# EAGLE schematic K019 (EAGLE 6.3), part 1 of 2

## Sheet 1 of 4
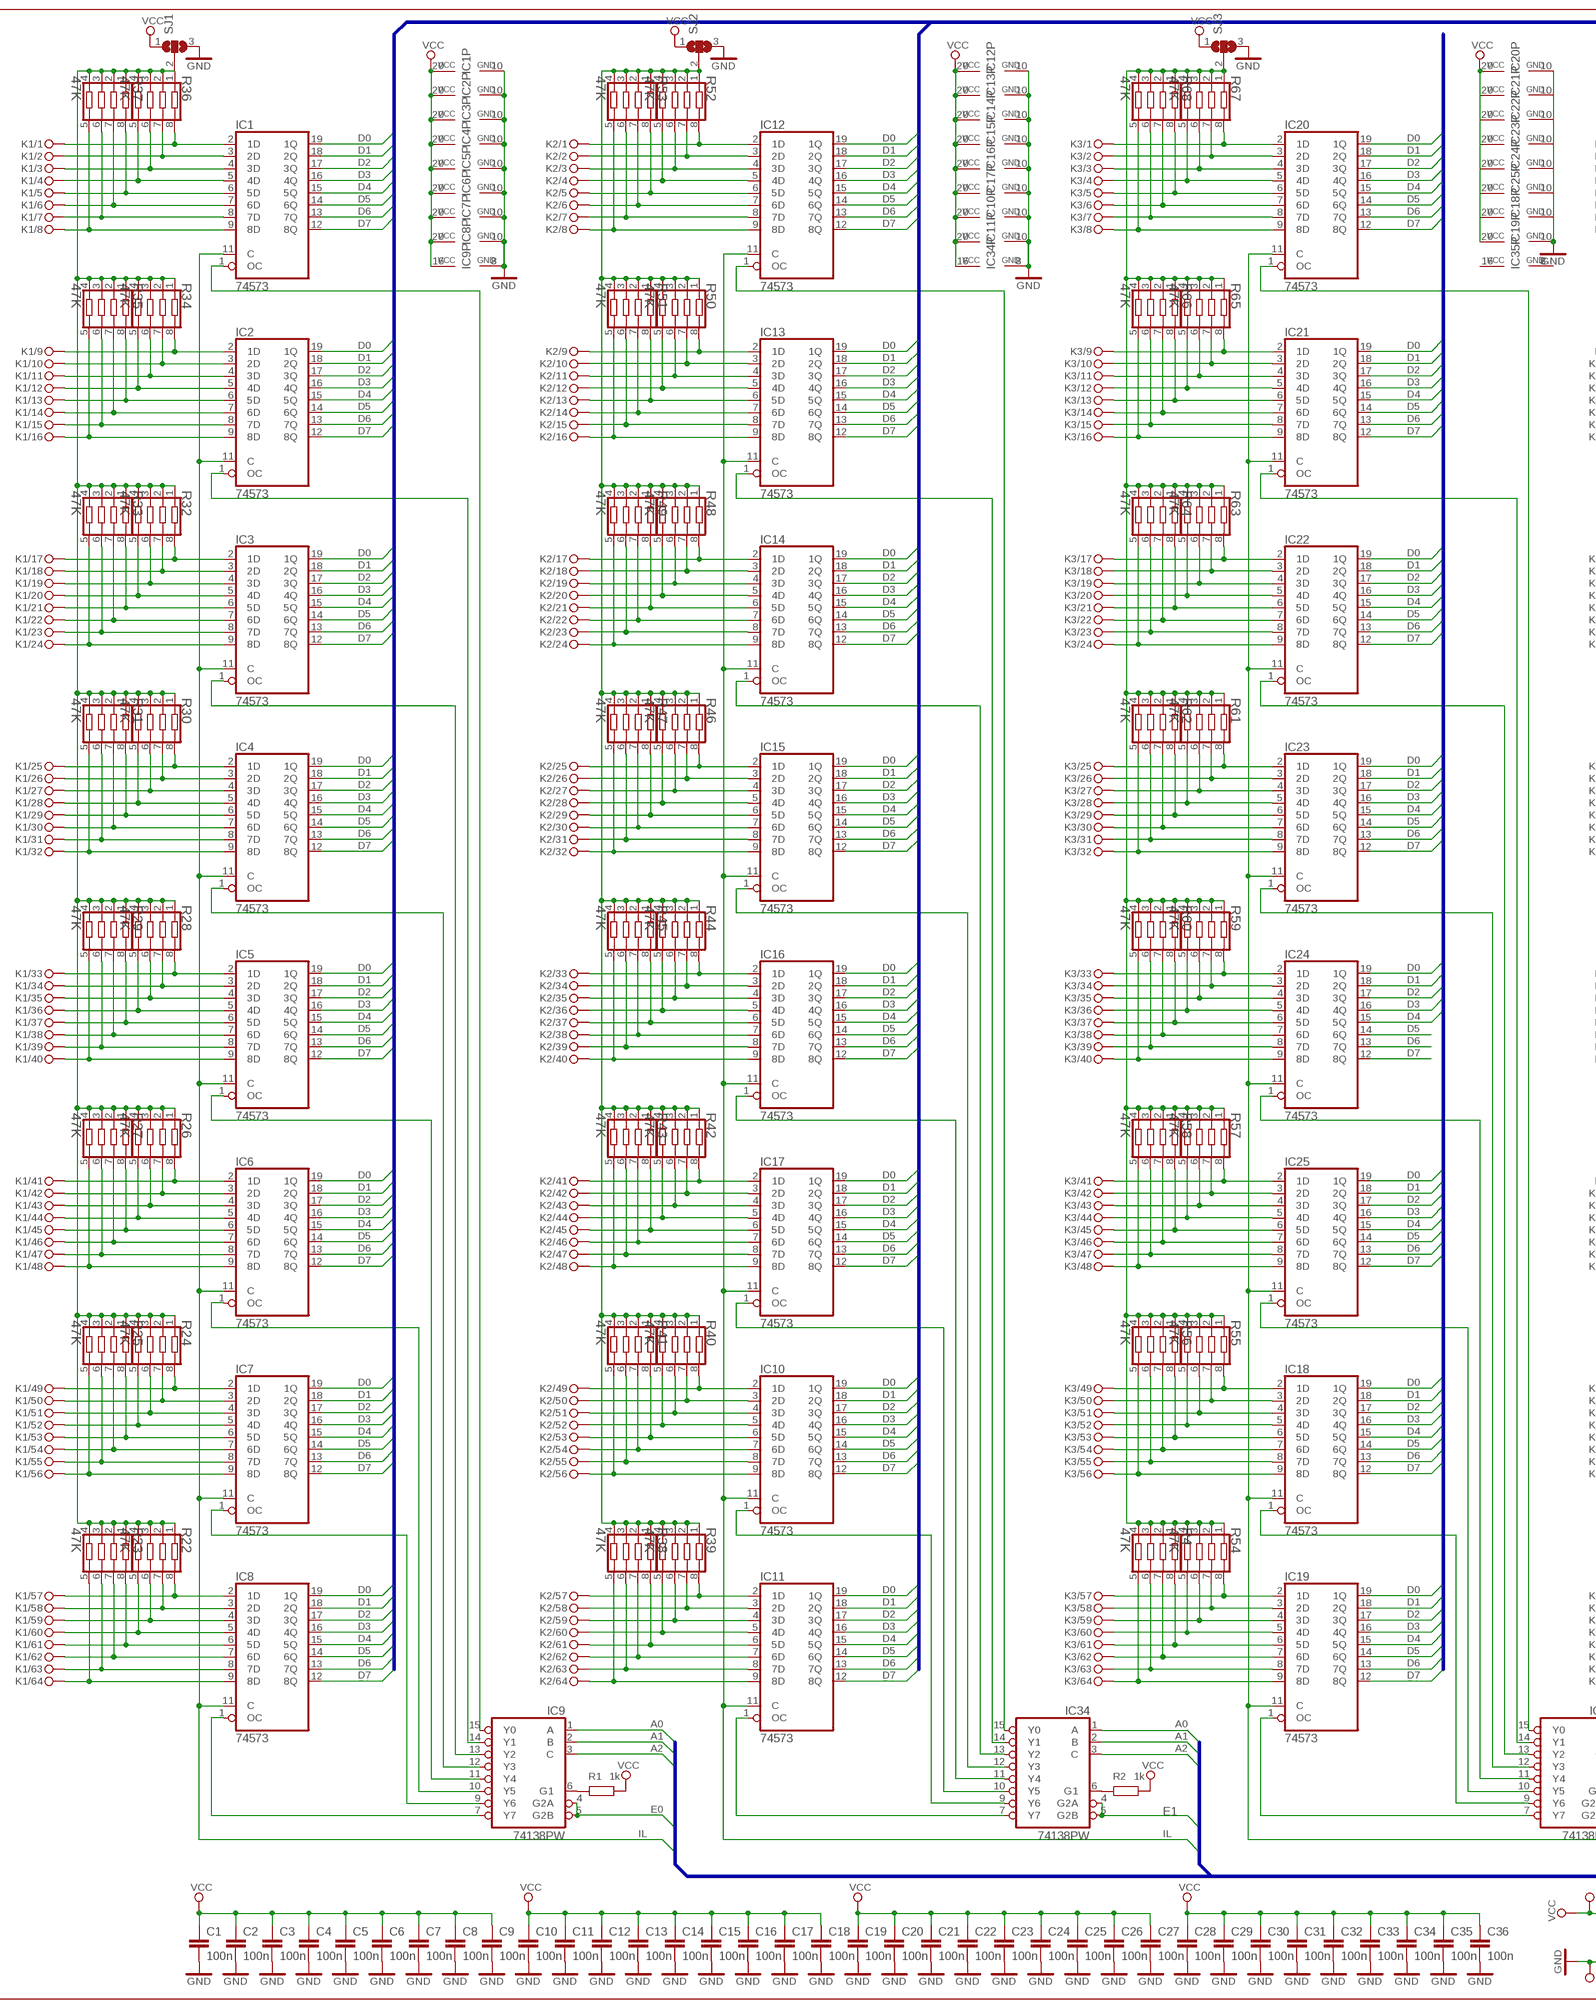
[diagram p0: schematic, sheet 1, part 1 of 2]
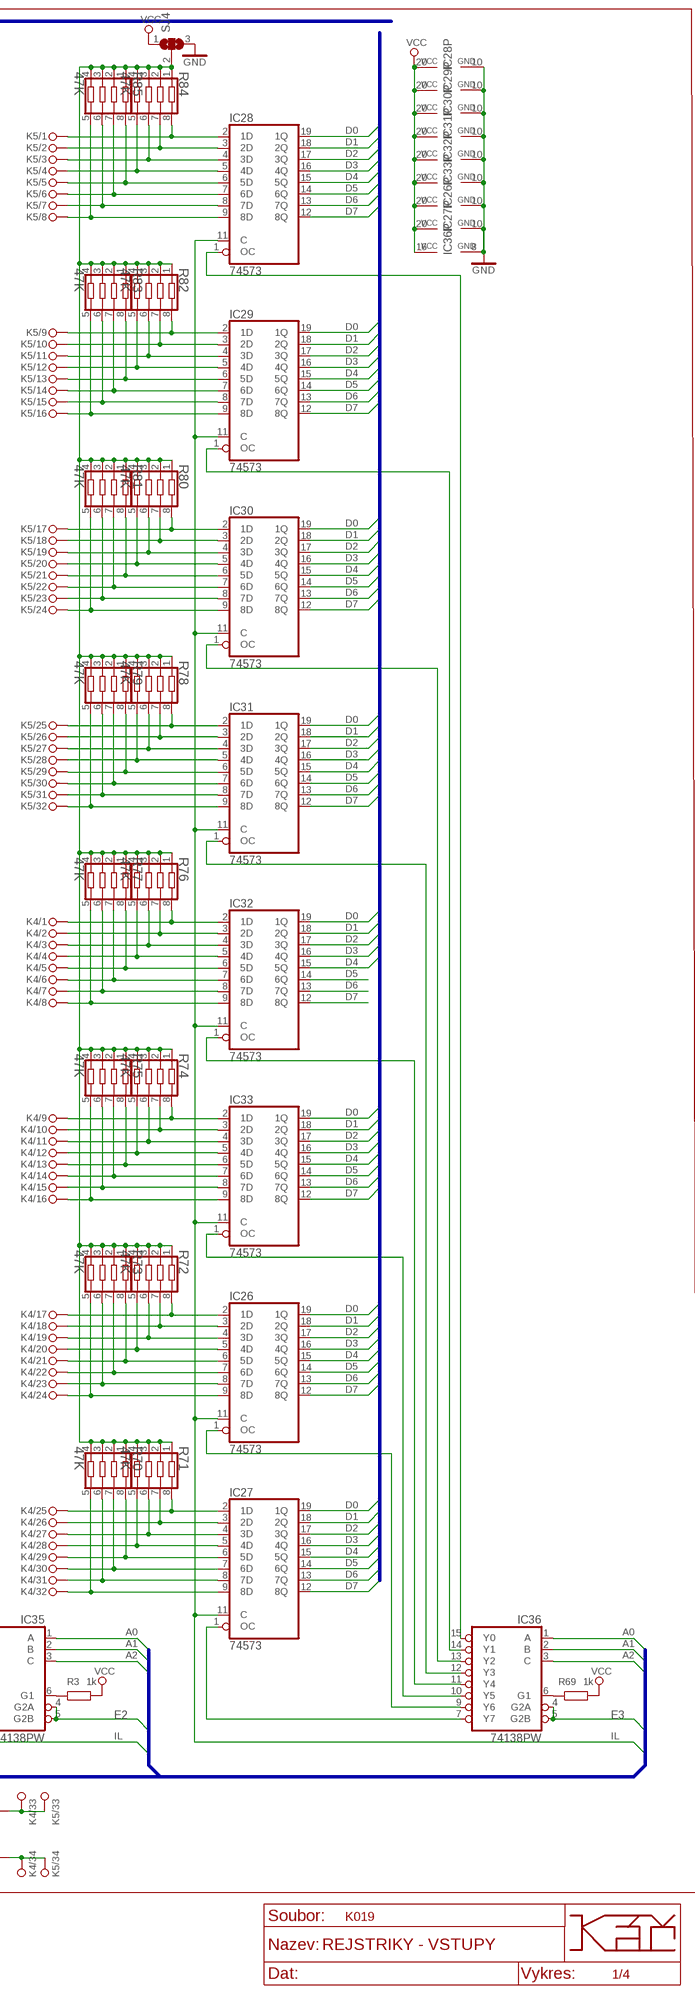
[diagram p1: schematic, sheet 1, part 2 of 2]

### Parts
C1  100n  C-EUC0603  [C0603]
C2  100n  C-EUC0603  [C0603]
C3  100n  C-EUC0603  [C0603]
C4  100n  C-EUC0603  [C0603]
C5  100n  C-EUC0603  [C0603]
C6  100n  C-EUC0603  [C0603]
C7  100n  C-EUC0603  [C0603]
C8  100n  C-EUC0603  [C0603]
C9  100n  C-EUC0603  [C0603]
C10  100n  C-EUC0603  [C0603]
C11  100n  C-EUC0603  [C0603]
C12  100n  C-EUC0603  [C0603]
C13  100n  C-EUC0603  [C0603]
C14  100n  C-EUC0603  [C0603]
C15  100n  C-EUC0603  [C0603]
C16  100n  C-EUC0603  [C0603]
C17  100n  C-EUC0603  [C0603]
C18  100n  C-EUC0603  [C0603]
C19  100n  C-EUC0603  [C0603]
C20  100n  C-EUC0603  [C0603]
C21  100n  C-EUC0603  [C0603]
C22  100n  C-EUC0603  [C0603]
C23  100n  C-EUC0603  [C0603]
C24  100n  C-EUC0603  [C0603]
C25  100n  C-EUC0603  [C0603]
C26  100n  C-EUC0603  [C0603]
C27  100n  C-EUC0603  [C0603]
C28  100n  C-EUC0603  [C0603]
C29  100n  C-EUC0603  [C0603]
C30  100n  C-EUC0603  [C0603]
C31  100n  C-EUC0603  [C0603]
C32  100n  C-EUC0603  [C0603]
C33  100n  C-EUC0603  [C0603]
C34  100n  C-EUC0603  [C0603]
C35  100n  C-EUC0603  [C0603]
C36  100n  C-EUC0603  [C0603]
IC1  74573  [TSSOP20]
IC2  74573  [TSSOP20]
IC3  74573  [TSSOP20]
IC4  74573  [TSSOP20]
IC5  74573  [TSSOP20]
IC6  74573  [TSSOP20]
IC7  74573  [TSSOP20]
IC8  74573  [TSSOP20]
IC9  74138PW  [TSSOP16]
IC10  74573  [TSSOP20]
IC11  74573  [TSSOP20]
IC12  74573  [TSSOP20]
IC13  74573  [TSSOP20]
IC14  74573  [TSSOP20]
IC15  74573  [TSSOP20]
IC16  74573  [TSSOP20]
IC17  74573  [TSSOP20]
IC18  74573  [TSSOP20]
IC19  74573  [TSSOP20]
IC20  74573  [TSSOP20]
IC21  74573  [TSSOP20]
IC22  74573  [TSSOP20]
IC23  74573  [TSSOP20]
IC24  74573  [TSSOP20]
IC25  74573  [TSSOP20]
IC26  74573  [TSSOP20]
IC27  74573  [TSSOP20]
IC28  74573  [TSSOP20]
IC29  74573  [TSSOP20]
IC30  74573  [TSSOP20]
IC31  74573  [TSSOP20]
IC32  74573  [TSSOP20]
IC33  74573  [TSSOP20]
IC34  74138PW  [TSSOP16]
IC35  74138PW  [TSSOP16]
IC36  74138PW  [TSSOP16]
K1  KON64  [KON64]
K2  KON64  [KON64]
K3  KON64  [KON64]
K4  KON34  [KON34]
K5  KON34  [KON34]
R1  1k  R-EU_R0603  [R0603]
R2  1k  R-EU_R0603  [R0603]
R3  1k  R-EU_R0603  [R0603]
R4  47K  EXB38V473JV  [RESCAXE80P320X160X60-8N]
R22  47K  EXB38V473JV  [RESCAXE80P320X160X60-8N]
R23  47K  EXB38V473JV  [RESCAXE80P320X160X60-8N]
R24  47K  EXB38V473JV  [RESCAXE80P320X160X60-8N]
R25  47K  EXB38V473JV  [RESCAXE80P320X160X60-8N]
R26  47K  EXB38V473JV  [RESCAXE80P320X160X60-8N]
R27  47K  EXB38V473JV  [RESCAXE80P320X160X60-8N]
R28  47K  EXB38V473JV  [RESCAXE80P320X160X60-8N]
R29  47K  EXB38V473JV  [RESCAXE80P320X160X60-8N]
R30  47K  EXB38V473JV  [RESCAXE80P320X160X60-8N]
R31  47K  EXB38V473JV  [RESCAXE80P320X160X60-8N]
R32  47K  EXB38V473JV  [RESCAXE80P320X160X60-8N]
R33  47K  EXB38V473JV  [RESCAXE80P320X160X60-8N]
R34  47K  EXB38V473JV  [RESCAXE80P320X160X60-8N]
R35  47K  EXB38V473JV  [RESCAXE80P320X160X60-8N]
R36  47K  EXB38V473JV  [RESCAXE80P320X160X60-8N]
R37  47K  EXB38V473JV  [RESCAXE80P320X160X60-8N]
R38  47K  EXB38V473JV  [RESCAXE80P320X160X60-8N]
R39  47K  EXB38V473JV  [RESCAXE80P320X160X60-8N]
R40  47K  EXB38V473JV  [RESCAXE80P320X160X60-8N]
R41  47K  EXB38V473JV  [RESCAXE80P320X160X60-8N]
R42  47K  EXB38V473JV  [RESCAXE80P320X160X60-8N]
R43  47K  EXB38V473JV  [RESCAXE80P320X160X60-8N]
R44  47K  EXB38V473JV  [RESCAXE80P320X160X60-8N]
R45  47K  EXB38V473JV  [RESCAXE80P320X160X60-8N]
R46  47K  EXB38V473JV  [RESCAXE80P320X160X60-8N]
R47  47K  EXB38V473JV  [RESCAXE80P320X160X60-8N]
R48  47K  EXB38V473JV  [RESCAXE80P320X160X60-8N]
R49  47K  EXB38V473JV  [RESCAXE80P320X160X60-8N]
R50  47K  EXB38V473JV  [RESCAXE80P320X160X60-8N]
R51  47K  EXB38V473JV  [RESCAXE80P320X160X60-8N]
R52  47K  EXB38V473JV  [RESCAXE80P320X160X60-8N]
R53  47K  EXB38V473JV  [RESCAXE80P320X160X60-8N]
R54  47K  EXB38V473JV  [RESCAXE80P320X160X60-8N]
R55  47K  EXB38V473JV  [RESCAXE80P320X160X60-8N]
R56  47K  EXB38V473JV  [RESCAXE80P320X160X60-8N]
R57  47K  EXB38V473JV  [RESCAXE80P320X160X60-8N]
R58  47K  EXB38V473JV  [RESCAXE80P320X160X60-8N]
R59  47K  EXB38V473JV  [RESCAXE80P320X160X60-8N]
R60  47K  EXB38V473JV  [RESCAXE80P320X160X60-8N]
R61  47K  EXB38V473JV  [RESCAXE80P320X160X60-8N]
R62  47K  EXB38V473JV  [RESCAXE80P320X160X60-8N]
R63  47K  EXB38V473JV  [RESCAXE80P320X160X60-8N]
R64  47K  EXB38V473JV  [RESCAXE80P320X160X60-8N]
R65  47K  EXB38V473JV  [RESCAXE80P320X160X60-8N]
R66  47K  EXB38V473JV  [RESCAXE80P320X160X60-8N]
R67  47K  EXB38V473JV  [RESCAXE80P320X160X60-8N]
R68  47K  EXB38V473JV  [RESCAXE80P320X160X60-8N]
R69  1k  R-EU_R0603  [R0603]
R70  47K  EXB38V473JV  [RESCAXE80P320X160X60-8N]
R71  47K  EXB38V473JV  [RESCAXE80P320X160X60-8N]
R72  47K  EXB38V473JV  [RESCAXE80P320X160X60-8N]
R73  47K  EXB38V473JV  [RESCAXE80P320X160X60-8N]
R74  47K  EXB38V473JV  [RESCAXE80P320X160X60-8N]
R75  47K  EXB38V473JV  [RESCAXE80P320X160X60-8N]
R76  47K  EXB38V473JV  [RESCAXE80P320X160X60-8N]
R77  47K  EXB38V473JV  [RESCAXE80P320X160X60-8N]
R78  47K  EXB38V473JV  [RESCAXE80P320X160X60-8N]
R79  47K  EXB38V473JV  [RESCAXE80P320X160X60-8N]
R80  47K  EXB38V473JV  [RESCAXE80P320X160X60-8N]
R81  47K  EXB38V473JV  [RESCAXE80P320X160X60-8N]
R82  47K  EXB38V473JV  [RESCAXE80P320X160X60-8N]
R83  47K  EXB38V473JV  [RESCAXE80P320X160X60-8N]
R84  47K  EXB38V473JV  [RESCAXE80P320X160X60-8N]
R85  47K  EXB38V473JV  [RESCAXE80P320X160X60-8N]
SJ1  SJ2W  [SJ_2]
SJ2  SJ2W  [SJ_2]
SJ3  SJ2W  [SJ_2]
SJ4  SJ2W  [SJ_2]

### Nets
A0: IC9.1(A) IC34.1(A) IC35.1(A) IC36.1(A) ; also sheet 2,3,4
A1: IC9.2(B) IC34.2(B) IC35.2(B) IC36.2(B) ; also sheet 2,3,4
A2: IC9.3(C) IC34.3(C) IC35.3(C) IC36.3(C) ; also sheet 2,3,4
D0: IC1.19(1Q) IC2.19(1Q) IC3.19(1Q) IC4.19(1Q) IC5.19(1Q) IC6.19(1Q) IC7.19(1Q) IC8.19(1Q) IC10.19(1Q) IC11.19(1Q) IC12.19(1Q) IC13.19(1Q) IC14.19(1Q) IC15.19(1Q) IC16.19(1Q) IC17.19(1Q) IC18.19(1Q) IC19.19(1Q) IC20.19(1Q) IC21.19(1Q) IC22.19(1Q) IC23.19(1Q) IC24.19(1Q) IC25.19(1Q) IC26.19(1Q) IC27.19(1Q) IC28.19(1Q) IC29.19(1Q) IC30.19(1Q) IC31.19(1Q) IC32.19(1Q) IC33.19(1Q) ; also sheet 2,3,4
D1: IC1.18(2Q) IC2.18(2Q) IC3.18(2Q) IC4.18(2Q) IC5.18(2Q) IC6.18(2Q) IC7.18(2Q) IC8.18(2Q) IC10.18(2Q) IC11.18(2Q) IC12.18(2Q) IC13.18(2Q) IC14.18(2Q) IC15.18(2Q) IC16.18(2Q) IC17.18(2Q) IC18.18(2Q) IC19.18(2Q) IC20.18(2Q) IC21.18(2Q) IC22.18(2Q) IC23.18(2Q) IC24.18(2Q) IC25.18(2Q) IC26.18(2Q) IC27.18(2Q) IC28.18(2Q) IC29.18(2Q) IC30.18(2Q) IC31.18(2Q) IC32.18(2Q) IC33.18(2Q) ; also sheet 2,3,4
D2: IC1.17(3Q) IC2.17(3Q) IC3.17(3Q) IC4.17(3Q) IC5.17(3Q) IC6.17(3Q) IC7.17(3Q) IC8.17(3Q) IC10.17(3Q) IC11.17(3Q) IC12.17(3Q) IC13.17(3Q) IC14.17(3Q) IC15.17(3Q) IC16.17(3Q) IC17.17(3Q) IC18.17(3Q) IC19.17(3Q) IC20.17(3Q) IC21.17(3Q) IC22.17(3Q) IC23.17(3Q) IC24.17(3Q) IC25.17(3Q) IC26.17(3Q) IC27.17(3Q) IC28.17(3Q) IC29.17(3Q) IC30.17(3Q) IC31.17(3Q) IC32.17(3Q) IC33.17(3Q) ; also sheet 2,3,4
D3: IC1.16(4Q) IC2.16(4Q) IC3.16(4Q) IC4.16(4Q) IC5.16(4Q) IC6.16(4Q) IC7.16(4Q) IC8.16(4Q) IC10.16(4Q) IC11.16(4Q) IC12.16(4Q) IC13.16(4Q) IC14.16(4Q) IC15.16(4Q) IC16.16(4Q) IC17.16(4Q) IC18.16(4Q) IC19.16(4Q) IC20.16(4Q) IC21.16(4Q) IC22.16(4Q) IC23.16(4Q) IC24.16(4Q) IC25.16(4Q) IC26.16(4Q) IC27.16(4Q) IC28.16(4Q) IC29.16(4Q) IC30.16(4Q) IC31.16(4Q) IC32.16(4Q) IC33.16(4Q) ; also sheet 2,3,4
D4: IC1.15(5Q) IC2.15(5Q) IC3.15(5Q) IC4.15(5Q) IC5.15(5Q) IC6.15(5Q) IC7.15(5Q) IC8.15(5Q) IC10.15(5Q) IC11.15(5Q) IC12.15(5Q) IC13.15(5Q) IC14.15(5Q) IC15.15(5Q) IC16.15(5Q) IC17.15(5Q) IC18.15(5Q) IC19.15(5Q) IC20.15(5Q) IC21.15(5Q) IC22.15(5Q) IC23.15(5Q) IC24.15(5Q) IC25.15(5Q) IC26.15(5Q) IC27.15(5Q) IC28.15(5Q) IC29.15(5Q) IC30.15(5Q) IC31.15(5Q) IC32.15(5Q) IC33.15(5Q) ; also sheet 2,3,4
D5: IC1.14(6Q) IC2.14(6Q) IC3.14(6Q) IC4.14(6Q) IC5.14(6Q) IC6.14(6Q) IC7.14(6Q) IC8.14(6Q) IC10.14(6Q) IC11.14(6Q) IC12.14(6Q) IC13.14(6Q) IC14.14(6Q) IC15.14(6Q) IC16.14(6Q) IC17.14(6Q) IC18.14(6Q) IC19.14(6Q) IC20.14(6Q) IC21.14(6Q) IC22.14(6Q) IC23.14(6Q) IC24.14(6Q) IC25.14(6Q) IC26.14(6Q) IC27.14(6Q) IC28.14(6Q) IC29.14(6Q) IC30.14(6Q) IC31.14(6Q) IC32.14(6Q) IC33.14(6Q) ; also sheet 2,3,4
D6: IC1.13(7Q) IC2.13(7Q) IC3.13(7Q) IC4.13(7Q) IC5.13(7Q) IC6.13(7Q) IC7.13(7Q) IC8.13(7Q) IC10.13(7Q) IC11.13(7Q) IC12.13(7Q) IC13.13(7Q) IC14.13(7Q) IC15.13(7Q) IC16.13(7Q) IC17.13(7Q) IC18.13(7Q) IC19.13(7Q) IC20.13(7Q) IC21.13(7Q) IC22.13(7Q) IC23.13(7Q) IC24.13(7Q) IC25.13(7Q) IC26.13(7Q) IC27.13(7Q) IC28.13(7Q) IC29.13(7Q) IC30.13(7Q) IC31.13(7Q) IC32.13(7Q) IC33.13(7Q) ; also sheet 2,3,4
D7: IC1.12(8Q) IC2.12(8Q) IC3.12(8Q) IC4.12(8Q) IC5.12(8Q) IC6.12(8Q) IC7.12(8Q) IC8.12(8Q) IC10.12(8Q) IC11.12(8Q) IC12.12(8Q) IC13.12(8Q) IC14.12(8Q) IC15.12(8Q) IC16.12(8Q) IC17.12(8Q) IC18.12(8Q) IC19.12(8Q) IC20.12(8Q) IC21.12(8Q) IC22.12(8Q) IC23.12(8Q) IC24.12(8Q) IC25.12(8Q) IC26.12(8Q) IC27.12(8Q) IC28.12(8Q) IC29.12(8Q) IC30.12(8Q) IC31.12(8Q) IC32.12(8Q) IC33.12(8Q) ; also sheet 2,3,4
E0: IC9.4(G2A) IC9.5(G2B) ; also sheet 4
E1: IC34.4(G2A) IC34.5(G2B) ; also sheet 4
E2: IC35.4(G2A) IC35.5(G2B) ; also sheet 4
E3: IC36.4(G2A) IC36.5(G2B) ; also sheet 4
GND: C1.2 C2.2 C3.2 C4.2 C5.2 C6.2 C7.2 C8.2 C9.2 C10.2 C11.2 C12.2 C13.2 C14.2 C15.2 C16.2 C17.2 C18.2 C19.2 C20.2 C21.2 C22.2 C23.2 C24.2 C25.2 C26.2 C27.2 C28.2 C29.2 C30.2 C31.2 C32.2 C33.2 C34.2 C35.2 C36.2 IC1.10(GND) IC2.10(GND) IC3.10(GND) IC4.10(GND) IC5.10(GND) IC6.10(GND) IC7.10(GND) IC8.10(GND) IC9.8(GND) IC10.10(GND) IC11.10(GND) IC12.10(GND) IC13.10(GND) IC14.10(GND) IC15.10(GND) IC16.10(GND) IC17.10(GND) IC18.10(GND) IC19.10(GND) IC20.10(GND) IC21.10(GND) IC22.10(GND) IC23.10(GND) IC24.10(GND) IC25.10(GND) IC26.10(GND) IC27.10(GND) IC28.10(GND) IC29.10(GND) IC30.10(GND) IC31.10(GND) IC32.10(GND) IC33.10(GND) IC36.8(GND) K4.34 K5.34 SJ1.3 SJ2.3 SJ3.3 SJ4.3 ; also sheet 2,3,4
IL: IC1.11(C) IC2.11(C) IC3.11(C) IC4.11(C) IC5.11(C) IC6.11(C) IC7.11(C) IC8.11(C) IC10.11(C) IC11.11(C) IC12.11(C) IC13.11(C) IC14.11(C) IC15.11(C) IC16.11(C) IC17.11(C) IC18.11(C) IC19.11(C) IC20.11(C) IC21.11(C) IC22.11(C) IC23.11(C) IC24.11(C) IC25.11(C) IC26.11(C) IC27.11(C) IC28.11(C) IC29.11(C) IC30.11(C) IC31.11(C) IC32.11(C) IC33.11(C) ; also sheet 4
N$1: IC8.1(OC) IC9.7(Y7)
N$2: IC7.1(OC) IC9.9(Y6)
N$3: IC6.1(OC) IC9.10(Y5)
N$4: IC5.1(OC) IC9.11(Y4)
N$5: IC4.1(OC) IC9.12(Y3)
N$6: IC3.1(OC) IC9.13(Y2)
N$7: IC2.1(OC) IC9.14(Y1)
N$8: IC1.1(OC) IC9.15(Y0)
N$9: IC11.1(OC) IC34.7(Y7)
N$10: IC1.2(1D) K1.1 R36.8
N$11: IC1.3(2D) K1.2 R36.7
N$12: IC1.4(3D) K1.3 R36.6
N$13: IC1.5(4D) K1.4 R36.5
N$14: IC1.6(5D) K1.5 R37.8
N$15: IC1.7(6D) K1.6 R37.7
N$16: IC1.8(7D) K1.7 R37.6
N$17: IC1.9(8D) K1.8 R37.5
N$18: IC2.2(1D) K1.9 R34.8
N$19: IC2.3(2D) K1.10 R34.7
N$20: IC2.4(3D) K1.11 R34.6
N$21: IC2.5(4D) K1.12 R34.5
N$22: IC2.6(5D) K1.13 R35.8
N$23: IC2.7(6D) K1.14 R35.7
N$24: IC2.8(7D) K1.15 R35.6
N$25: IC2.9(8D) K1.16 R35.5
N$26: IC3.2(1D) K1.17 R32.8
N$27: IC10.1(OC) IC34.9(Y6)
N$28: IC3.4(3D) K1.19 R32.6
N$29: IC3.5(4D) K1.20 R32.5
N$30: IC3.6(5D) K1.21 R33.8
N$31: IC3.7(6D) K1.22 R33.7
N$32: IC3.8(7D) K1.23 R33.6
N$33: IC3.9(8D) K1.24 R33.5
N$34: IC4.2(1D) K1.25 R30.8
N$35: IC4.3(2D) K1.26 R30.7
N$36: IC4.4(3D) K1.27 R30.6
N$37: IC4.5(4D) K1.28 R30.5
N$38: IC4.6(5D) K1.29 R31.8
N$39: IC4.7(6D) K1.30 R31.7
N$40: IC4.8(7D) K1.31 R31.6
N$41: IC4.9(8D) K1.32 R31.5
N$42: IC5.2(1D) K1.33 R28.8
N$43: IC5.3(2D) K1.34 R28.7
N$44: IC5.4(3D) K1.35 R28.6
N$45: IC5.5(4D) K1.36 R28.5
N$46: IC5.6(5D) K1.37 R29.8
N$47: IC5.7(6D) K1.38 R29.7
N$48: IC5.8(7D) K1.39 R29.6
N$49: IC5.9(8D) K1.40 R29.5
N$50: IC6.2(1D) K1.41 R26.8
N$51: IC6.3(2D) K1.42 R26.7
N$52: IC6.4(3D) K1.43 R26.6
N$53: IC6.5(4D) K1.44 R26.5
N$54: IC6.6(5D) K1.45 R27.8
N$55: IC6.7(6D) K1.46 R27.7
N$56: IC6.8(7D) K1.47 R27.6
N$57: IC6.9(8D) K1.48 R27.5
N$58: IC7.2(1D) K1.49 R24.8
N$59: IC7.3(2D) K1.50 R24.7
N$60: IC7.4(3D) K1.51 R24.6
N$61: IC7.5(4D) K1.52 R24.5
N$62: IC7.6(5D) K1.53 R25.8
N$63: IC7.7(6D) K1.54 R25.7
N$64: IC7.8(7D) K1.55 R25.6
N$65: IC7.9(8D) K1.56 R25.5
N$66: IC8.2(1D) K1.57 R22.8
N$67: IC8.3(2D) K1.58 R22.7
N$68: IC8.4(3D) K1.59 R22.6
N$69: IC8.5(4D) K1.60 R22.5
N$70: IC8.6(5D) K1.61 R23.8
N$71: IC8.7(6D) K1.62 R23.7
N$72: IC8.8(7D) K1.63 R23.6
N$73: IC8.9(8D) K1.64 R23.5
N$74: IC17.1(OC) IC34.10(Y5)
N$75: IC16.1(OC) IC34.11(Y4)
N$76: R22.1 R22.2 R22.3 R22.4 R23.1 R23.2 R23.3 R23.4 R24.1 R24.2 R24.3 R24.4 R25.1 R25.2 R25.3 R25.4 R26.1 R26.2 R26.3 R26.4 R27.1 R27.2 R27.3 R27.4 R28.1 R28.2 R28.3 R28.4 R29.1 R29.2 R29.3 R29.4 R30.1 R30.2 R30.3 R30.4 R31.1 R31.2 R31.3 R31.4 R32.1 R32.2 R32.3 R32.4 R33.1 R33.2 R33.3 R33.4 R34.1 R34.2 R34.3 R34.4 R35.1 R35.2 R35.3 R35.4 R36.1 R36.2 R36.3 R36.4 R37.1 R37.2 R37.3 R37.4 SJ1.2
N$77: IC15.1(OC) IC34.12(Y3)
N$78: IC14.1(OC) IC34.13(Y2)
N$79: IC13.1(OC) IC34.14(Y1)
N$80: IC12.1(OC) IC34.15(Y0)
N$81: IC19.1(OC) IC35.7(Y7)
N$82: IC18.1(OC) IC35.9(Y6)
N$83: IC9.6(G1) R1.1
N$84: IC25.1(OC) IC35.10(Y5)
N$85: IC24.1(OC) IC35.11(Y4)
N$86: IC3.3(2D) K1.18 R32.7
N$87: IC23.1(OC) IC35.12(Y3)
N$88: IC22.1(OC) IC35.13(Y2)
N$89: IC21.1(OC) IC35.14(Y1)
N$90: IC20.1(OC) IC35.15(Y0)
N$92: IC27.1(OC) IC36.7(Y7)
N$93: IC26.1(OC) IC36.9(Y6)
N$94: IC33.1(OC) IC36.10(Y5)
N$95: IC32.1(OC) IC36.11(Y4)
N$96: IC31.1(OC) IC36.12(Y3)
N$97: IC30.1(OC) IC36.13(Y2)
N$98: IC29.1(OC) IC36.14(Y1)
N$99: IC28.1(OC) IC36.15(Y0)
N$151: R38.1 R38.2 R38.3 R38.4 R39.1 R39.2 R39.3 R39.4 R40.1 R40.2 R40.3 R40.4 R41.1 R41.2 R41.3 R41.4 R42.1 R42.2 R42.3 R42.4 R43.1 R43.2 R43.3 R43.4 R44.1 R44.2 R44.3 R44.4 R45.1 R45.2 R45.3 R45.4 R46.1 R46.2 R46.3 R46.4 R47.1 R47.2 R47.3 R47.4 R48.1 R48.2 R48.3 R48.4 R49.1 R49.2 R49.3 R49.4 R50.1 R50.2 R50.3 R50.4 R51.1 R51.2 R51.3 R51.4 R52.1 R52.2 R52.3 R52.4 R53.1 R53.2 R53.3 R53.4 SJ2.2
N$220: R4.1 R4.2 R4.3 R4.4 R54.1 R54.2 R54.3 R54.4 R55.1 R55.2 R55.3 R55.4 R56.1 R56.2 R56.3 R56.4 R57.1 R57.2 R57.3 R57.4 R58.1 R58.2 R58.3 R58.4 R59.1 R59.2 R59.3 R59.4 R60.1 R60.2 R60.3 R60.4 R61.1 R61.2 R61.3 R61.4 R62.1 R62.2 R62.3 R62.4 R63.1 R63.2 R63.3 R63.4 R64.1 R64.2 R64.3 R64.4 R65.1 R65.2 R65.3 R65.4 R66.1 R66.2 R66.3 R66.4 R67.1 R67.2 R67.3 R67.4 R68.1 R68.2 R68.3 R68.4 SJ3.2
N$418: R70.1 R70.2 R70.3 R70.4 R71.1 R71.2 R71.3 R71.4 R72.1 R72.2 R72.3 R72.4 R73.1 R73.2 R73.3 R73.4 R74.1 R74.2 R74.3 R74.4 R75.1 R75.2 R75.3 R75.4 R76.1 R76.2 R76.3 R76.4 R77.1 R77.2 R77.3 R77.4 R78.1 R78.2 R78.3 R78.4 R79.1 R79.2 R79.3 R79.4 R80.1 R80.2 R80.3 R80.4 R81.1 R81.2 R81.3 R81.4 R82.1 R82.2 R82.3 R82.4 R83.1 R83.2 R83.3 R83.4 R84.1 R84.2 R84.3 R84.4 R85.1 R85.2 R85.3 R85.4 SJ4.2
N$419: IC12.2(1D) K2.1 R52.8
N$1295: IC12.3(2D) K2.2 R52.7
N$1296: IC12.4(3D) K2.3 R52.6
N$1297: IC12.5(4D) K2.4 R52.5
N$1298: IC12.6(5D) K2.5 R53.8
N$1299: IC12.7(6D) K2.6 R53.7
N$1300: IC12.8(7D) K2.7 R53.6
N$1301: IC12.9(8D) K2.8 R53.5
N$1302: IC13.2(1D) K2.9 R50.8
N$1303: IC13.3(2D) K2.10 R50.7
N$1304: IC13.4(3D) K2.11 R50.6
N$1305: IC13.5(4D) K2.12 R50.5
N$1306: IC13.6(5D) K2.13 R51.8
N$1307: IC13.7(6D) K2.14 R51.7
N$1308: IC13.8(7D) K2.15 R51.6
N$1309: IC13.9(8D) K2.16 R51.5
N$1310: IC14.2(1D) K2.17 R48.8
N$1311: IC14.3(2D) K2.18 R48.7
N$1312: IC14.4(3D) K2.19 R48.6
N$1313: IC14.5(4D) K2.20 R48.5
N$1314: IC14.6(5D) K2.21 R49.8
N$1315: IC14.7(6D) K2.22 R49.7
N$1316: IC14.8(7D) K2.23 R49.6
N$1317: IC14.9(8D) K2.24 R49.5
N$1318: IC15.2(1D) K2.25 R46.8
N$1319: IC15.3(2D) K2.26 R46.7
N$1320: IC15.4(3D) K2.27 R46.6
N$1321: IC15.5(4D) K2.28 R46.5
N$1322: IC15.6(5D) K2.29 R47.8
N$1323: IC15.7(6D) K2.30 R47.7
N$1324: IC15.8(7D) K2.31 R47.6
N$1325: IC15.9(8D) K2.32 R47.5
N$1326: IC16.2(1D) K2.33 R44.8
N$1327: IC16.3(2D) K2.34 R44.7
N$1328: IC16.4(3D) K2.35 R44.6
N$1329: IC16.5(4D) K2.36 R44.5
N$1330: IC16.6(5D) K2.37 R45.8
N$1331: IC16.7(6D) K2.38 R45.7
N$1332: IC16.8(7D) K2.39 R45.6
N$1333: IC16.9(8D) K2.40 R45.5
N$1334: IC17.2(1D) K2.41 R42.8
N$1335: IC17.3(2D) K2.42 R42.7
N$1336: IC17.4(3D) K2.43 R42.6
N$1337: IC17.5(4D) K2.44 R42.5
N$1338: IC17.6(5D) K2.45 R43.8
N$1339: IC17.7(6D) K2.46 R43.7
N$1340: IC17.8(7D) K2.47 R43.6
N$1341: IC17.9(8D) K2.48 R43.5
N$1342: IC10.2(1D) K2.49 R40.8
N$1343: IC10.3(2D) K2.50 R40.7
N$1344: IC10.4(3D) K2.51 R40.6
N$1345: IC10.5(4D) K2.52 R40.5
N$1346: IC10.6(5D) K2.53 R41.8
N$1347: IC10.7(6D) K2.54 R41.7
N$1348: IC10.8(7D) K2.55 R41.6
N$1349: IC10.9(8D) K2.56 R41.5
N$1350: IC11.2(1D) K2.57 R39.8
N$1351: IC11.3(2D) K2.58 R39.7
N$1352: IC11.4(3D) K2.59 R39.6
N$1353: IC11.5(4D) K2.60 R39.5
N$1354: IC11.6(5D) K2.61 R38.8
N$1355: IC11.7(6D) K2.62 R38.7
N$1356: IC11.8(7D) K2.63 R38.6
N$1357: IC11.9(8D) K2.64 R38.5
N$1358: IC19.2(1D) K3.57 R54.8
N$1359: IC19.3(2D) K3.58 R54.7
N$1360: IC19.4(3D) K3.59 R54.6
N$1361: IC19.5(4D) K3.60 R54.5
N$1362: IC19.6(5D) K3.61 R4.8
N$1363: IC19.7(6D) K3.62 R4.7
N$1364: IC19.8(7D) K3.63 R4.6
N$1365: IC19.9(8D) K3.64 R4.5
N$1366: IC18.2(1D) K3.49 R55.8
N$1367: IC18.3(2D) K3.50 R55.7
N$1368: IC18.4(3D) K3.51 R55.6
N$1369: IC18.5(4D) K3.52 R55.5
N$1370: IC18.6(5D) K3.53 R56.8
N$1371: IC18.7(6D) K3.54 R56.7
N$1372: IC18.8(7D) K3.55 R56.6
N$1373: IC18.9(8D) K3.56 R56.5
N$1374: IC25.2(1D) K3.41 R57.8
N$1375: IC25.3(2D) K3.42 R57.7
N$1376: IC25.4(3D) K3.43 R57.6
N$1377: IC25.5(4D) K3.44 R57.5
N$1378: IC25.6(5D) K3.45 R58.8
N$1379: IC25.7(6D) K3.46 R58.7
N$1380: IC25.8(7D) K3.47 R58.6
N$1381: IC25.9(8D) K3.48 R58.5
N$1382: IC24.2(1D) K3.33 R59.8
N$1383: IC24.3(2D) K3.34 R59.7
N$1384: IC24.4(3D) K3.35 R59.6
N$1385: IC24.5(4D) K3.36 R59.5
N$1386: IC24.6(5D) K3.37 R60.8
N$1387: IC24.7(6D) K3.38 R60.7
N$1388: IC24.8(7D) K3.39 R60.6
N$1389: IC24.9(8D) K3.40 R60.5
N$1390: IC23.2(1D) K3.25 R61.8
N$1391: IC23.3(2D) K3.26 R61.7
N$1392: IC23.4(3D) K3.27 R61.6
N$1393: IC23.5(4D) K3.28 R61.5
N$1394: IC23.6(5D) K3.29 R62.8
N$1395: IC23.7(6D) K3.30 R62.7
N$1396: IC23.8(7D) K3.31 R62.6
N$1397: IC23.9(8D) K3.32 R62.5
N$1398: IC22.2(1D) K3.17 R63.8
N$1399: IC22.3(2D) K3.18 R63.7
N$1400: IC22.4(3D) K3.19 R63.6
N$1401: IC22.5(4D) K3.20 R63.5
N$1402: IC22.6(5D) K3.21 R64.8
N$1403: IC22.7(6D) K3.22 R64.7
N$1404: IC22.8(7D) K3.23 R64.6
N$1405: IC22.9(8D) K3.24 R64.5
N$1406: IC21.2(1D) K3.9 R65.8
N$1407: IC21.3(2D) K3.10 R65.7
N$1408: IC21.4(3D) K3.11 R65.6
N$1409: IC21.5(4D) K3.12 R65.5
N$1410: IC21.6(5D) K3.13 R66.8
N$1411: IC21.7(6D) K3.14 R66.7
N$1412: IC21.8(7D) K3.15 R66.6
N$1413: IC21.9(8D) K3.16 R66.5
N$1414: IC20.2(1D) K3.1 R67.8
N$1415: IC20.3(2D) K3.2 R67.7
N$1416: IC20.4(3D) K3.3 R67.6
N$1417: IC20.5(4D) K3.4 R67.5
N$1418: IC20.6(5D) K3.5 R68.8
N$1419: IC20.7(6D) K3.6 R68.7
N$1420: IC20.8(7D) K3.7 R68.6
N$1421: IC20.9(8D) K3.8 R68.5
N$1422: IC28.2(1D) K5.1 R84.8
N$1423: IC28.3(2D) K5.2 R84.7
N$1424: IC28.4(3D) K5.3 R84.6
N$1425: IC28.5(4D) K5.4 R84.5
N$1426: IC28.6(5D) K5.5 R85.8
N$1427: IC28.7(6D) K5.6 R85.7
N$1428: IC28.8(7D) K5.7 R85.6
N$1429: IC28.9(8D) K5.8 R85.5
N$1430: IC29.2(1D) K5.9 R82.8
N$1431: IC29.3(2D) K5.10 R82.7
N$1432: IC29.4(3D) K5.11 R82.6
N$1433: IC29.5(4D) K5.12 R82.5
N$1434: IC29.6(5D) K5.13 R83.8
N$1435: IC29.7(6D) K5.14 R83.7
N$1436: IC29.8(7D) K5.15 R83.6
N$1437: IC29.9(8D) K5.16 R83.5
N$1438: IC30.2(1D) K5.17 R80.8
N$1439: IC30.3(2D) K5.18 R80.7
N$1440: IC30.4(3D) K5.19 R80.6
N$1441: IC30.5(4D) K5.20 R80.5
N$1442: IC30.6(5D) K5.21 R81.8
N$1443: IC30.7(6D) K5.22 R81.7
N$1444: IC30.8(7D) K5.23 R81.6
N$1445: IC30.9(8D) K5.24 R81.5
N$1446: IC31.2(1D) K5.25 R78.8
N$1447: IC31.3(2D) K5.26 R78.7
N$1448: IC31.4(3D) K5.27 R78.6
N$1449: IC31.5(4D) K5.28 R78.5
N$1450: IC31.6(5D) K5.29 R79.8
N$1451: IC31.7(6D) K5.30 R79.7
N$1452: IC31.8(7D) K5.31 R79.6
N$1453: IC31.9(8D) K5.32 R79.5
N$1454: IC32.2(1D) K4.1 R76.8
N$1455: IC32.3(2D) K4.2 R76.7
N$1456: IC32.4(3D) K4.3 R76.6
N$1457: IC32.5(4D) K4.4 R76.5
N$1458: IC32.6(5D) K4.5 R77.8
N$1459: IC32.7(6D) K4.6 R77.7
N$1460: IC32.8(7D) K4.7 R77.6
N$1461: IC32.9(8D) K4.8 R77.5
N$1462: IC33.2(1D) K4.9 R74.8
N$1463: IC33.3(2D) K4.10 R74.7
N$1464: IC33.4(3D) K4.11 R74.6
N$1465: IC33.5(4D) K4.12 R74.5
N$1466: IC33.6(5D) K4.13 R75.8
N$1467: IC33.7(6D) K4.14 R75.7
N$1468: IC33.8(7D) K4.15 R75.6
N$1469: IC33.9(8D) K4.16 R75.5
N$1470: IC26.2(1D) K4.17 R72.8
N$1471: IC26.3(2D) K4.18 R72.7
N$1472: IC26.4(3D) K4.19 R72.6
N$1473: IC26.5(4D) K4.20 R72.5
N$1474: IC26.6(5D) K4.21 R73.8
N$1475: IC26.7(6D) K4.22 R73.7
N$1476: IC26.8(7D) K4.23 R73.6
N$1477: IC26.9(8D) K4.24 R73.5
N$1478: IC27.2(1D) K4.25 R71.8
N$1479: IC27.3(2D) K4.26 R71.7
N$1480: IC27.4(3D) K4.27 R71.6
N$1481: IC27.5(4D) K4.28 R71.5
N$1482: IC27.6(5D) K4.29 R70.8
N$1483: IC27.7(6D) K4.30 R70.7
N$1484: IC27.8(7D) K4.31 R70.6
N$1485: IC27.9(8D) K4.32 R70.5
N$1486: IC34.6(G1) R2.1
N$1487: IC36.6(G1) R69.1
N$1488: IC35.6(G1) R3.1
VCC: C1.1 C2.1 C3.1 C4.1 C5.1 C6.1 C7.1 C8.1 C9.1 C10.1 C11.1 C12.1 C13.1 C14.1 C15.1 C16.1 C17.1 C18.1 C19.1 C20.1 C21.1 C22.1 C23.1 C24.1 C25.1 C26.1 C27.1 C28.1 C29.1 C30.1 C31.1 C32.1 C33.1 C34.1 C35.1 C36.1 IC1.20(VCC) IC2.20(VCC) IC3.20(VCC) IC4.20(VCC) IC5.20(VCC) IC6.20(VCC) IC7.20(VCC) IC8.20(VCC) IC9.16(VCC) IC10.20(VCC) IC11.20(VCC) IC12.20(VCC) IC13.20(VCC) IC14.20(VCC) IC15.20(VCC) IC16.20(VCC) IC17.20(VCC) IC18.20(VCC) IC19.20(VCC) IC20.20(VCC) IC21.20(VCC) IC22.20(VCC) IC23.20(VCC) IC24.20(VCC) IC25.20(VCC) IC26.20(VCC) IC27.20(VCC) IC28.20(VCC) IC29.20(VCC) IC30.20(VCC) IC31.20(VCC) IC32.20(VCC) IC33.20(VCC) IC34.16(VCC) IC36.16(VCC) K4.33 K5.33 R1.2 R2.2 R3.2 R69.2 SJ1.1 SJ2.1 SJ3.1 SJ4.1 ; also sheet 2,3,4

### Buses
D[0..7]
A[0..5],E[0..15],IL,OL

### Notes on the sheet
- REJSTRIKY - VSTUPY

## Sheet 2 of 4
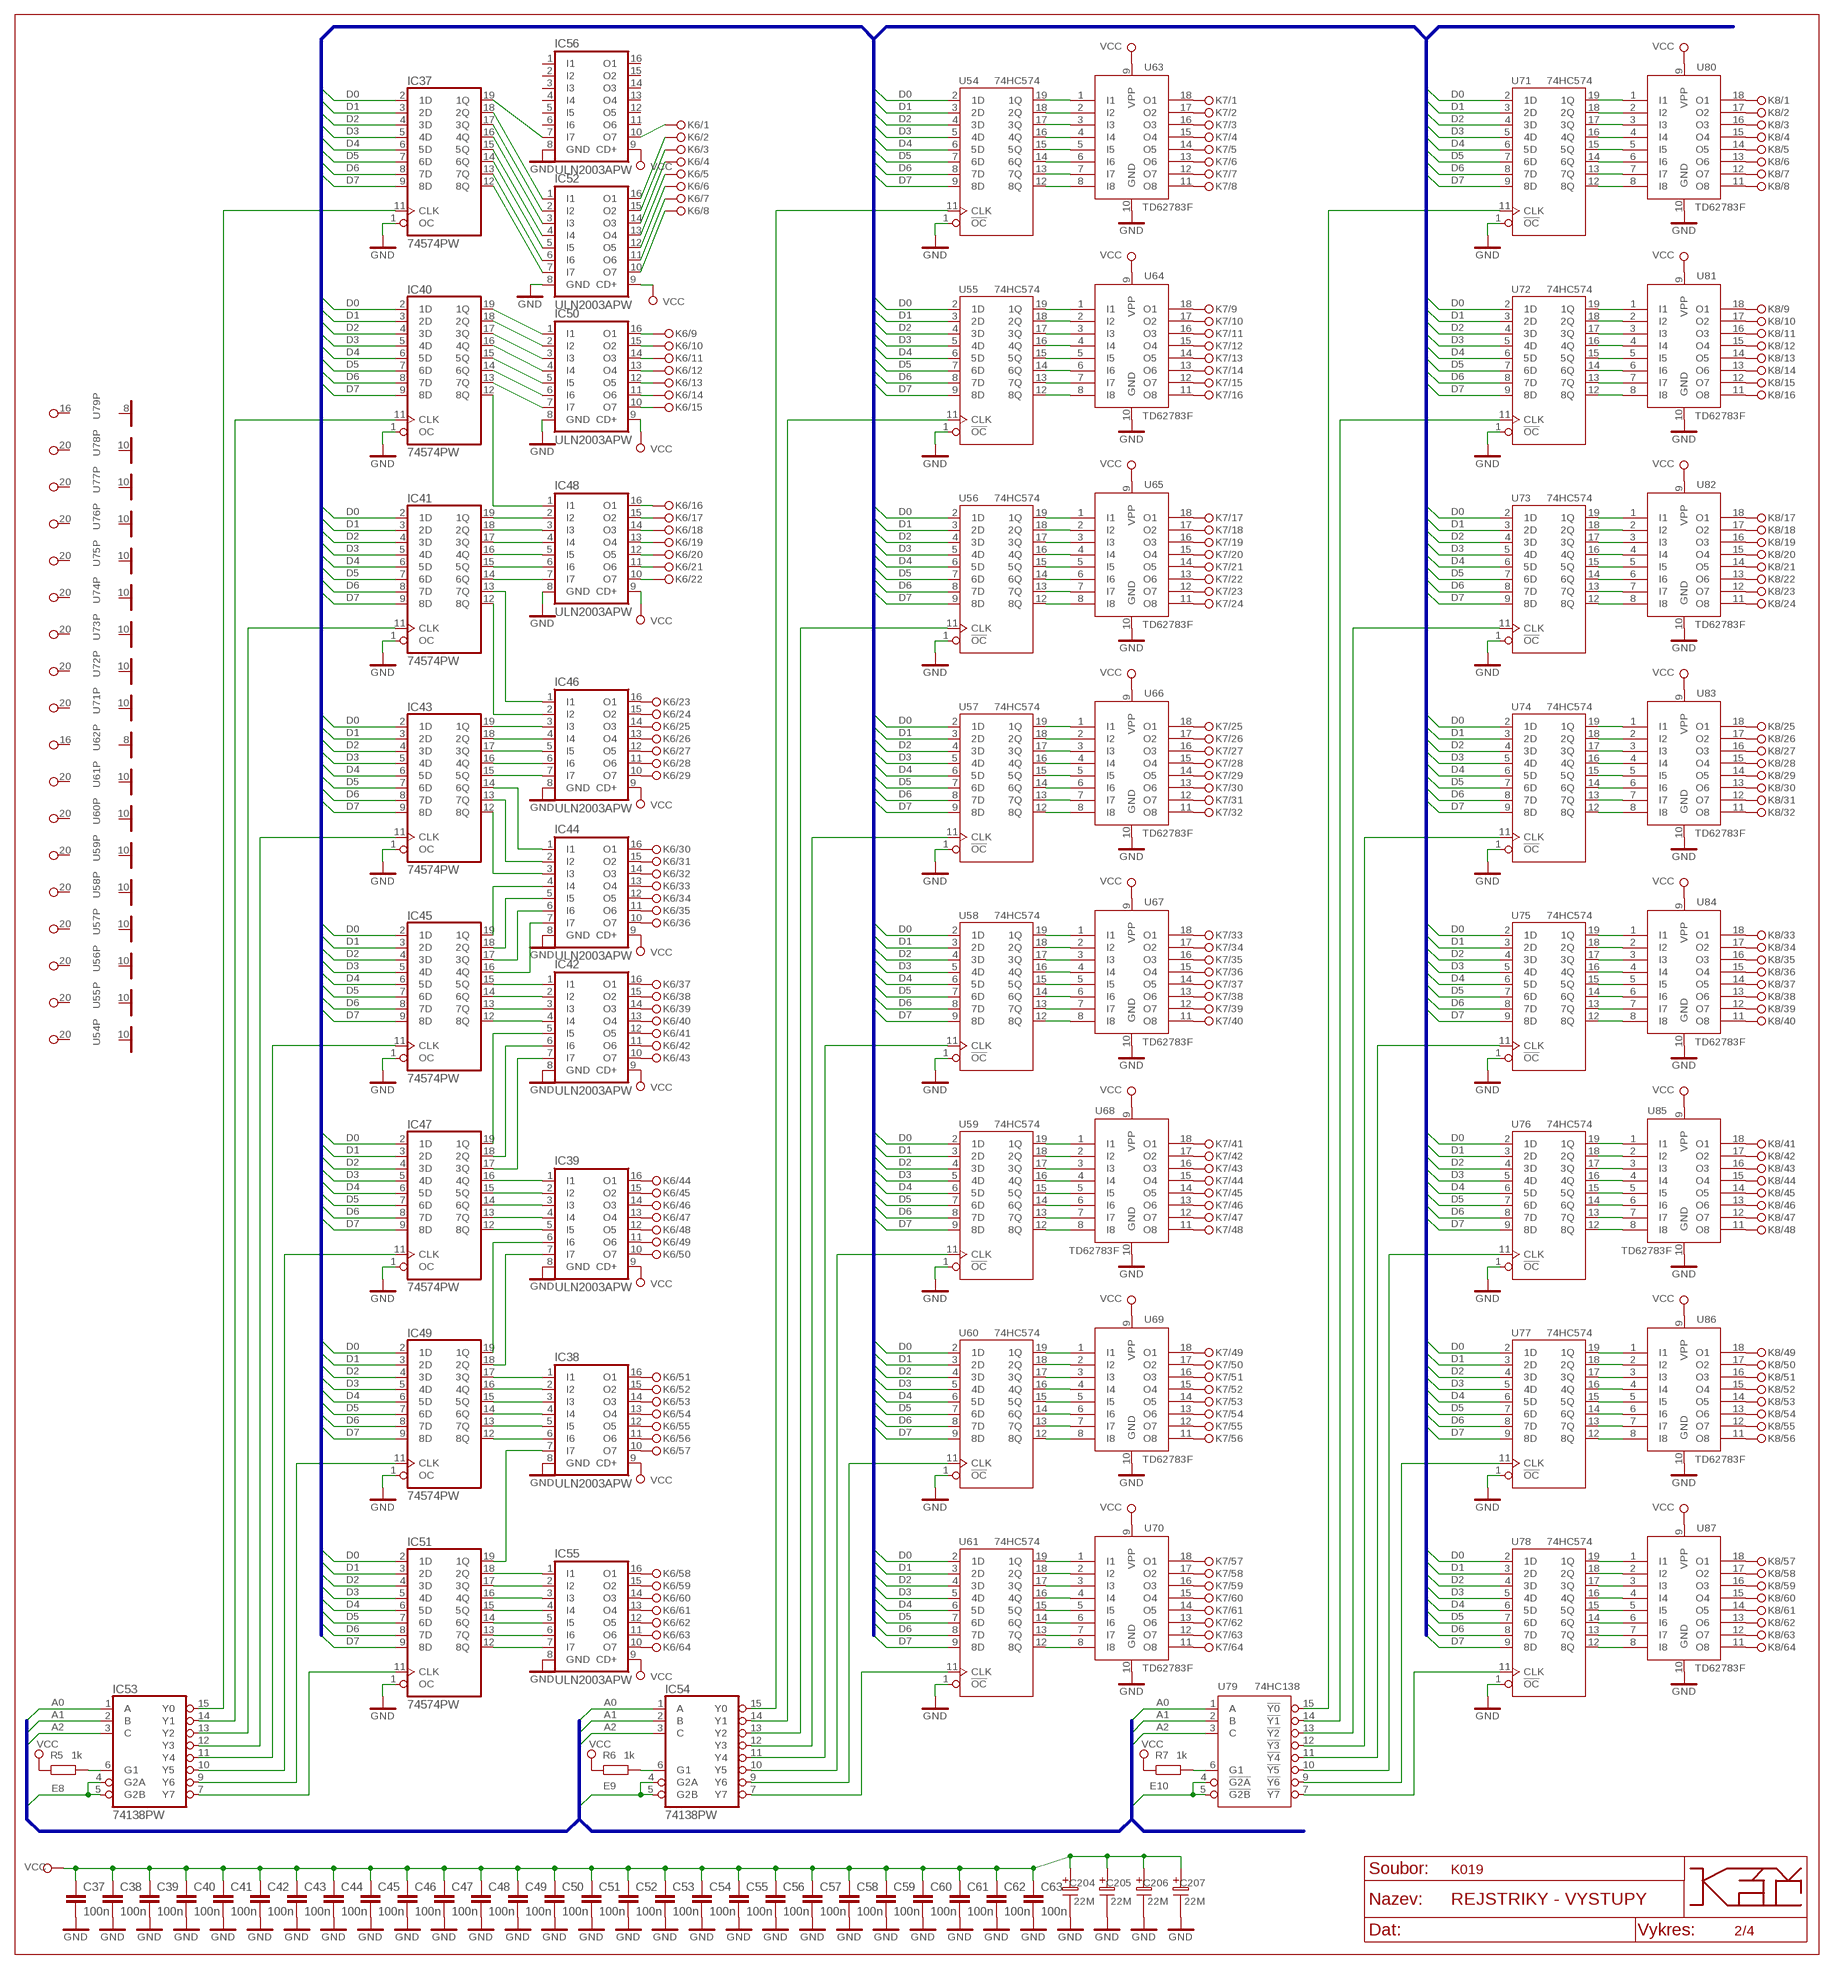
[diagram p2: schematic, sheet 2]

### Parts
C37  100n  C-EUC0603  [C0603]
C38  100n  C-EUC0603  [C0603]
C39  100n  C-EUC0603  [C0603]
C40  100n  C-EUC0603  [C0603]
C41  100n  C-EUC0603  [C0603]
C42  100n  C-EUC0603  [C0603]
C43  100n  C-EUC0603  [C0603]
C44  100n  C-EUC0603  [C0603]
C45  100n  C-EUC0603  [C0603]
C46  100n  C-EUC0603  [C0603]
C47  100n  C-EUC0603  [C0603]
C48  100n  C-EUC0603  [C0603]
C49  100n  C-EUC0603  [C0603]
C50  100n  C-EUC0603  [C0603]
C51  100n  C-EUC0603  [C0603]
C52  100n  C-EUC0603  [C0603]
C53  100n  C-EUC0603  [C0603]
C54  100n  C-EUC0603  [C0603]
C55  100n  C-EUC0603  [C0603]
C56  100n  C-EUC0603  [C0603]
C57  100n  C-EUC0603  [C0603]
C58  100n  C-EUC0603  [C0603]
C59  100n  C-EUC0603  [C0603]
C60  100n  C-EUC0603  [C0603]
C61  100n  C-EUC0603  [C0603]
C62  100n  C-EUC0603  [C0603]
C63  100n  C-EUC0603  [C0603]
C204  22M  EC-2/5  [EC-2/5]
C205  22M  EC-2/5  [EC-2/5]
C206  22M  EC-2/5  [EC-2/5]
C207  22M  EC-2/5  [EC-2/5]
IC37  74574PW  [TSSOP20]
IC38  ULN2003APW  [SSOP16]
IC39  ULN2003APW  [SSOP16]
IC40  74574PW  [TSSOP20]
IC41  74574PW  [TSSOP20]
IC42  ULN2003APW  [SSOP16]
IC43  74574PW  [TSSOP20]
IC44  ULN2003APW  [SSOP16]
IC45  74574PW  [TSSOP20]
IC46  ULN2003APW  [SSOP16]
IC47  74574PW  [TSSOP20]
IC48  ULN2003APW  [SSOP16]
IC49  74574PW  [TSSOP20]
IC50  ULN2003APW  [SSOP16]
IC51  74574PW  [TSSOP20]
IC52  ULN2003APW  [SSOP16]
IC53  74138PW  [TSSOP16]
IC54  74138PW  [TSSOP16]
IC55  ULN2003APW  [SSOP16]
IC56  ULN2003APW  [SSOP16]
K6  KON64  [KON64]
K7  KON64  [KON64]
K8  KON64  [KON64]
R5  1k  R-EU_R0603  [R0603]
R6  1k  R-EU_R0603  [R0603]
R7  1k  R-EU_R0603  [R0603]
U54  74HC574  74AC574@2  [DIL20]
U55  74HC574  74AC574@2  [DIL20]
U56  74HC574  74AC574@2  [DIL20]
U57  74HC574  74AC574@2  [DIL20]
U58  74HC574  74AC574@2  [DIL20]
U59  74HC574  74AC574@2  [DIL20]
U60  74HC574  74AC574@2  [DIL20]
U61  74HC574  74AC574@2  [DIL20]
U62  74HC138  74AC138  [DIL16]
U63  TD62783F  TD62783F@2  [DIL18]
U64  TD62783F  TD62783F@2  [DIL18]
U65  TD62783F  TD62783F@2  [DIL18]
U66  TD62783F  TD62783F@2  [DIL18]
U67  TD62783F  TD62783F@2  [DIL18]
U68  TD62783F  TD62783F@2  [DIL18]
U69  TD62783F  TD62783F@2  [DIL18]
U70  TD62783F  TD62783F@2  [DIL18]
U71  74HC574  74AC574@2  [DIL20]
U72  74HC574  74AC574@2  [DIL20]
U73  74HC574  74AC574@2  [DIL20]
U74  74HC574  74AC574@2  [DIL20]
U75  74HC574  74AC574@2  [DIL20]
U76  74HC574  74AC574@2  [DIL20]
U77  74HC574  74AC574@2  [DIL20]
U78  74HC574  74AC574@2  [DIL20]
U79  74HC138  74AC138  [DIL16]
U80  TD62783F  TD62783F@2  [DIL18]
U81  TD62783F  TD62783F@2  [DIL18]
U82  TD62783F  TD62783F@2  [DIL18]
U83  TD62783F  TD62783F@2  [DIL18]
U84  TD62783F  TD62783F@2  [DIL18]
U85  TD62783F  TD62783F@2  [DIL18]
U86  TD62783F  TD62783F@2  [DIL18]
U87  TD62783F  TD62783F@2  [DIL18]

### Nets
A0: IC53.1(A) IC54.1(A) U79.1(A) ; also sheet 1,3,4
A1: IC53.2(B) IC54.2(B) U79.2(B) ; also sheet 1,3,4
A2: IC53.3(C) IC54.3(C) U79.3(C) ; also sheet 1,3,4
D0: IC37.2(1D) IC40.2(1D) IC41.2(1D) IC43.2(1D) IC45.2(1D) IC47.2(1D) IC49.2(1D) IC51.2(1D) U54.2(1D) U55.2(1D) U56.2(1D) U57.2(1D) U58.2(1D) U59.2(1D) U60.2(1D) U61.2(1D) U71.2(1D) U72.2(1D) U73.2(1D) U74.2(1D) U75.2(1D) U76.2(1D) U77.2(1D) U78.2(1D) ; also sheet 1,3,4
D1: IC37.3(2D) IC40.3(2D) IC41.3(2D) IC43.3(2D) IC45.3(2D) IC47.3(2D) IC49.3(2D) IC51.3(2D) U54.3(2D) U55.3(2D) U56.3(2D) U57.3(2D) U58.3(2D) U59.3(2D) U60.3(2D) U61.3(2D) U71.3(2D) U72.3(2D) U73.3(2D) U74.3(2D) U75.3(2D) U76.3(2D) U77.3(2D) U78.3(2D) ; also sheet 1,3,4
D2: IC37.4(3D) IC40.4(3D) IC41.4(3D) IC43.4(3D) IC45.4(3D) IC47.4(3D) IC49.4(3D) IC51.4(3D) U54.4(3D) U55.4(3D) U56.4(3D) U57.4(3D) U58.4(3D) U59.4(3D) U60.4(3D) U61.4(3D) U71.4(3D) U72.4(3D) U73.4(3D) U74.4(3D) U75.4(3D) U76.4(3D) U77.4(3D) U78.4(3D) ; also sheet 1,3,4
D3: IC37.5(4D) IC40.5(4D) IC41.5(4D) IC43.5(4D) IC45.5(4D) IC47.5(4D) IC49.5(4D) IC51.5(4D) U54.5(4D) U55.5(4D) U56.5(4D) U57.5(4D) U58.5(4D) U59.5(4D) U60.5(4D) U61.5(4D) U71.5(4D) U72.5(4D) U73.5(4D) U74.5(4D) U75.5(4D) U76.5(4D) U77.5(4D) U78.5(4D) ; also sheet 1,3,4
D4: IC37.6(5D) IC40.6(5D) IC41.6(5D) IC43.6(5D) IC45.6(5D) IC47.6(5D) IC49.6(5D) IC51.6(5D) U54.6(5D) U55.6(5D) U56.6(5D) U57.6(5D) U58.6(5D) U59.6(5D) U60.6(5D) U61.6(5D) U71.6(5D) U72.6(5D) U73.6(5D) U74.6(5D) U75.6(5D) U76.6(5D) U77.6(5D) U78.6(5D) ; also sheet 1,3,4
D5: IC37.7(6D) IC40.7(6D) IC41.7(6D) IC43.7(6D) IC45.7(6D) IC47.7(6D) IC49.7(6D) IC51.7(6D) U54.7(6D) U55.7(6D) U56.7(6D) U57.7(6D) U58.7(6D) U59.7(6D) U60.7(6D) U61.7(6D) U71.7(6D) U72.7(6D) U73.7(6D) U74.7(6D) U75.7(6D) U76.7(6D) U77.7(6D) U78.7(6D) ; also sheet 1,3,4
D6: IC37.8(7D) IC40.8(7D) IC41.8(7D) IC43.8(7D) IC45.8(7D) IC47.8(7D) IC49.8(7D) IC51.8(7D) U54.8(7D) U55.8(7D) U56.8(7D) U57.8(7D) U58.8(7D) U59.8(7D) U60.8(7D) U61.8(7D) U71.8(7D) U72.8(7D) U73.8(7D) U74.8(7D) U75.8(7D) U76.8(7D) U77.8(7D) U78.8(7D) ; also sheet 1,3,4
D7: IC37.9(8D) IC40.9(8D) IC41.9(8D) IC43.9(8D) IC45.9(8D) IC47.9(8D) IC49.9(8D) IC51.9(8D) U54.9(8D) U55.9(8D) U56.9(8D) U57.9(8D) U58.9(8D) U59.9(8D) U60.9(8D) U61.9(8D) U71.9(8D) U72.9(8D) U73.9(8D) U74.9(8D) U75.9(8D) U76.9(8D) U77.9(8D) U78.9(8D) ; also sheet 1,3,4
E8: IC53.4(G2A) IC53.5(G2B) ; also sheet 4
E9: IC54.4(G2A) IC54.5(G2B) ; also sheet 4
E10: U79.4(!G2A) U79.5(!G2B) ; also sheet 4
GND: C37.2 C38.2 C39.2 C40.2 C41.2 C42.2 C43.2 C44.2 C45.2 C46.2 C47.2 C48.2 C49.2 C50.2 C51.2 C52.2 C53.2 C54.2 C55.2 C56.2 C57.2 C58.2 C59.2 C60.2 C61.2 C62.2 C63.2 C204.1 C205.1 C206.1 C207.1 IC37.1(OC) IC38.8(GND) IC39.8(GND) IC40.1(OC) IC41.1(OC) IC42.8(GND) IC43.1(OC) IC44.8(GND) IC45.1(OC) IC46.8(GND) IC47.1(OC) IC48.8(GND) IC49.1(OC) IC50.8(GND) IC51.1(OC) IC52.8(GND) IC55.8(GND) IC56.8(GND) U54.1(!OC) U55.1(!OC) U56.1(!OC) U57.1(!OC) U58.1(!OC) U59.1(!OC) U60.1(!OC) U61.1(!OC) U63.10(GND) U64.10(GND) U65.10(GND) U66.10(GND) U67.10(GND) U68.10(GND) U69.10(GND) U70.10(GND) U71.1(!OC) U72.1(!OC) U73.1(!OC) U74.1(!OC) U75.1(!OC) U76.1(!OC) U77.1(!OC) U78.1(!OC) U80.10(GND) U81.10(GND) U82.10(GND) U83.10(GND) U84.10(GND) U85.10(GND) U86.10(GND) U87.10(GND) ; also sheet 1,3,4
N$101: IC55.16(O1) K6.58
N$102: IC55.15(O2) K6.59
N$103: IC55.14(O3) K6.60
N$104: IC55.13(O4) K6.61
N$105: IC55.12(O5) K6.62
N$106: IC55.11(O6) K6.63
N$107: IC55.10(O7) K6.64
N$108: IC38.16(O1) K6.51
N$109: IC38.15(O2) K6.52
N$110: IC38.14(O3) K6.53
N$111: IC38.13(O4) K6.54
N$112: IC38.12(O5) K6.55
N$113: IC38.11(O6) K6.56
N$114: IC38.10(O7) K6.57
N$115: IC39.6(I6) IC49.19(1Q)
N$116: IC39.7(I7) IC49.18(2Q)
N$117: IC39.11(O6) K6.49
N$118: IC39.10(O7) K6.50
N$119: IC39.16(O1) K6.44
N$120: IC39.15(O2) K6.45
N$121: IC39.14(O3) K6.46
N$122: IC39.13(O4) K6.47
N$123: IC39.12(O5) K6.48
N$124: IC42.5(I5) IC47.19(1Q)
N$125: IC42.6(I6) IC47.18(2Q)
N$126: IC42.7(I7) IC47.17(3Q)
N$127: IC42.10(O7) K6.43
N$128: IC42.12(O5) K6.41
N$129: IC42.11(O6) K6.42
N$136: IC42.16(O1) K6.37
N$150: IC42.15(O2) K6.38
N$158: IC42.14(O3) K6.39
N$159: IC42.13(O4) K6.40
N$160: IC44.7(I7) IC45.16(4Q)
N$161: IC44.6(I6) IC45.17(3Q)
N$162: IC44.5(I5) IC45.18(2Q)
N$163: IC44.4(I4) IC45.19(1Q)
N$164: IC44.10(O7) K6.36
N$165: IC44.11(O6) K6.35
N$166: IC44.12(O5) K6.34
N$167: IC44.13(O4) K6.33
N$168: IC44.14(O3) K6.32
N$169: IC44.15(O2) K6.31
N$170: IC44.16(O1) K6.30
N$171: IC43.12(8Q) IC44.3(I3)
N$172: IC43.13(7Q) IC44.2(I2)
N$173: IC41.13(7Q) IC46.1(I1)
N$174: IC46.14(O3) K6.25
N$175: IC46.13(O4) K6.26
N$176: IC46.12(O5) K6.27
N$177: IC46.11(O6) K6.28
N$178: IC46.10(O7) K6.29
N$179: IC43.14(6Q) IC44.1(I1)
N$180: IC41.12(8Q) IC46.2(I2)
N$181: IC46.15(O2) K6.24
N$182: IC46.16(O1) K6.23
N$183: IC48.15(O2) K6.17
N$184: IC48.14(O3) K6.18
N$185: IC48.13(O4) K6.19
N$186: IC48.12(O5) K6.20
N$187: IC48.11(O6) K6.21
N$188: IC48.10(O7) K6.22
N$189: IC48.16(O1) K6.16
N$190: IC52.16(O1) K6.2
N$191: IC52.15(O2) K6.3
N$192: IC52.14(O3) K6.4
N$193: IC52.13(O4) K6.5
N$194: IC52.12(O5) K6.6
N$195: IC52.11(O6) K6.7
N$196: IC52.10(O7) K6.8
N$197: IC50.16(O1) K6.9
N$198: IC50.15(O2) K6.10
N$199: IC50.14(O3) K6.11
N$200: IC50.13(O4) K6.12
N$201: IC50.12(O5) K6.13
N$202: IC50.11(O6) K6.14
N$203: IC50.10(O7) K6.15
N$204: IC56.10(O7) K6.1
N$353: IC51.12(8Q) IC55.7(I7)
N$354: IC51.13(7Q) IC55.6(I6)
N$355: IC51.14(6Q) IC55.5(I5)
N$356: IC51.15(5Q) IC55.4(I4)
N$357: IC51.16(4Q) IC55.3(I3)
N$358: IC51.17(3Q) IC55.2(I2)
N$359: IC51.18(2Q) IC55.1(I1)
N$360: IC38.7(I7) IC51.19(1Q)
N$361: IC38.6(I6) IC49.12(8Q)
N$362: IC38.5(I5) IC49.13(7Q)
N$363: IC38.4(I4) IC49.14(6Q)
N$364: IC38.3(I3) IC49.15(5Q)
N$365: IC38.2(I2) IC49.16(4Q)
N$366: IC38.1(I1) IC49.17(3Q)
N$373: IC42.1(I1) IC45.15(5Q)
N$374: IC42.2(I2) IC45.14(6Q)
N$375: IC42.3(I3) IC45.13(7Q)
N$376: IC42.4(I4) IC45.12(8Q)
N$377: IC39.5(I5) IC47.12(8Q)
N$378: IC39.4(I4) IC47.13(7Q)
N$379: IC39.3(I3) IC47.14(6Q)
N$380: IC39.2(I2) IC47.15(5Q)
N$381: IC39.1(I1) IC47.16(4Q)
N$387: IC43.15(5Q) IC46.7(I7)
N$388: IC43.16(4Q) IC46.6(I6)
N$389: IC43.17(3Q) IC46.5(I5)
N$390: IC43.18(2Q) IC46.4(I4)
N$391: IC43.19(1Q) IC46.3(I3)
N$392: IC40.19(1Q) IC50.1(I1)
N$393: IC40.18(2Q) IC50.2(I2)
N$394: IC40.17(3Q) IC50.3(I3)
N$395: IC40.16(4Q) IC50.4(I4)
N$396: IC40.15(5Q) IC50.5(I5)
N$397: IC40.14(6Q) IC50.6(I6)
N$398: IC40.13(7Q) IC50.7(I7)
N$399: IC40.12(8Q) IC48.1(I1)
N$400: IC41.19(1Q) IC48.2(I2)
N$401: IC41.18(2Q) IC48.3(I3)
N$402: IC41.17(3Q) IC48.4(I4)
N$403: IC41.16(4Q) IC48.5(I5)
N$404: IC41.15(5Q) IC48.6(I6)
N$405: IC41.14(6Q) IC48.7(I7)
N$408: IC37.12(8Q) IC52.7(I7)
N$409: IC37.13(7Q) IC52.6(I6)
N$410: IC37.14(6Q) IC52.5(I5)
N$411: IC37.15(5Q) IC52.4(I4)
N$412: IC37.16(4Q) IC52.3(I3)
N$413: IC37.17(3Q) IC52.2(I2)
N$414: IC37.18(2Q) IC52.1(I1)
N$415: IC37.19(1Q) IC56.7(I7)
N$421: IC51.11(CLK) IC53.7(Y7)
N$422: IC49.11(CLK) IC53.9(Y6)
N$423: IC47.11(CLK) IC53.10(Y5)
N$424: IC45.11(CLK) IC53.11(Y4)
N$425: IC43.11(CLK) IC53.12(Y3)
N$426: IC41.11(CLK) IC53.13(Y2)
N$427: IC40.11(CLK) IC53.14(Y1)
N$428: IC37.11(CLK) IC53.15(Y0)
N$429: IC53.6(G1) R5.2
N$430: K7.1 U63.18(O1)
N$431: K7.2 U63.17(O2)
N$432: K7.3 U63.16(O3)
N$433: K7.4 U63.15(O4)
N$434: K7.5 U63.14(O5)
N$435: K7.6 U63.13(O6)
N$436: K7.7 U63.12(O7)
N$437: K7.8 U63.11(O8)
N$438: K7.9 U64.18(O1)
N$439: K7.10 U64.17(O2)
N$440: K7.11 U64.16(O3)
N$441: K7.12 U64.15(O4)
N$442: K7.13 U64.14(O5)
N$443: K7.14 U64.13(O6)
N$444: K7.15 U64.12(O7)
N$445: K7.16 U64.11(O8)
N$446: K7.25 U66.18(O1)
N$447: K7.26 U66.17(O2)
N$448: K7.27 U66.16(O3)
N$449: K7.28 U66.15(O4)
N$450: K7.29 U66.14(O5)
N$451: K7.30 U66.13(O6)
N$452: K7.31 U66.12(O7)
N$453: K7.32 U66.11(O8)
N$454: K7.33 U67.18(O1)
N$455: K7.34 U67.17(O2)
N$456: K7.35 U67.16(O3)
N$457: K7.36 U67.15(O4)
N$458: K7.37 U67.14(O5)
N$459: K7.38 U67.13(O6)
N$460: K7.39 U67.12(O7)
N$461: K7.40 U67.11(O8)
N$462: K7.41 U68.18(O1)
N$463: K7.42 U68.17(O2)
N$464: K7.43 U68.16(O3)
N$465: K7.44 U68.15(O4)
N$466: K7.45 U68.14(O5)
N$467: K7.46 U68.13(O6)
N$468: K7.47 U68.12(O7)
N$469: K7.48 U68.11(O8)
N$470: K7.49 U69.18(O1)
N$471: K7.50 U69.17(O2)
N$472: K7.51 U69.16(O3)
N$473: K7.52 U69.15(O4)
N$474: K7.53 U69.14(O5)
N$475: K7.54 U69.13(O6)
N$476: K7.55 U69.12(O7)
N$477: K7.56 U69.11(O8)
N$478: K7.57 U70.18(O1)
N$479: K7.58 U70.17(O2)
N$480: K7.59 U70.16(O3)
N$481: K7.60 U70.15(O4)
N$482: K7.61 U70.14(O5)
N$483: K7.62 U70.13(O6)
N$484: K7.63 U70.12(O7)
N$485: K7.64 U70.11(O8)
N$486: U61.12(8Q) U70.8(I8)
N$487: U61.13(7Q) U70.7(I7)
N$488: U61.14(6Q) U70.6(I6)
N$489: U61.15(5Q) U70.5(I5)
N$490: U61.16(4Q) U70.4(I4)
N$491: U61.17(3Q) U70.3(I3)
N$492: U61.18(2Q) U70.2(I2)
N$493: U61.19(1Q) U70.1(I1)
N$494: U60.12(8Q) U69.8(I8)
N$495: U60.13(7Q) U69.7(I7)
N$496: U60.14(6Q) U69.6(I6)
N$497: U60.15(5Q) U69.5(I5)
N$498: U60.16(4Q) U69.4(I4)
N$499: U60.17(3Q) U69.3(I3)
N$500: U60.18(2Q) U69.2(I2)
N$501: U60.19(1Q) U69.1(I1)
N$502: U58.19(1Q) U67.1(I1)
N$503: U58.18(2Q) U67.2(I2)
N$504: U58.17(3Q) U67.3(I3)
N$505: U58.16(4Q) U67.4(I4)
N$506: U58.15(5Q) U67.5(I5)
N$507: U58.14(6Q) U67.6(I6)
N$508: U58.13(7Q) U67.7(I7)
N$509: U58.12(8Q) U67.8(I8)
N$510: U59.19(1Q) U68.1(I1)
N$511: U59.18(2Q) U68.2(I2)
N$512: U59.17(3Q) U68.3(I3)
N$513: U59.16(4Q) U68.4(I4)
N$514: U59.15(5Q) U68.5(I5)
N$515: U59.14(6Q) U68.6(I6)
N$516: U59.13(7Q) U68.7(I7)
N$517: K7.17 U65.18(O1)
N$518: K7.18 U65.17(O2)
N$519: K7.19 U65.16(O3)
N$520: K7.20 U65.15(O4)
N$521: K7.21 U65.14(O5)
N$522: K7.22 U65.13(O6)
N$523: K7.23 U65.12(O7)
N$524: K7.24 U65.11(O8)
N$525: U57.12(8Q) U66.8(I8)
N$526: U57.13(7Q) U66.7(I7)
N$527: U57.14(6Q) U66.6(I6)
N$528: U57.15(5Q) U66.5(I5)
N$529: U57.16(4Q) U66.4(I4)
N$530: U57.17(3Q) U66.3(I3)
N$531: U57.18(2Q) U66.2(I2)
N$532: U57.19(1Q) U66.1(I1)
N$533: U55.19(1Q) U64.1(I1)
N$534: U55.18(2Q) U64.2(I2)
N$535: U55.17(3Q) U64.3(I3)
N$536: U55.16(4Q) U64.4(I4)
N$537: U55.15(5Q) U64.5(I5)
N$538: U55.14(6Q) U64.6(I6)
N$539: U55.13(7Q) U64.7(I7)
N$540: U55.12(8Q) U64.8(I8)
N$541: U56.19(1Q) U65.1(I1)
N$542: U56.18(2Q) U65.2(I2)
N$543: U56.17(3Q) U65.3(I3)
N$544: U56.16(4Q) U65.4(I4)
N$545: U56.15(5Q) U65.5(I5)
N$546: U56.14(6Q) U65.6(I6)
N$547: U56.13(7Q) U65.7(I7)
N$548: U56.12(8Q) U65.8(I8)
N$549: U54.12(8Q) U63.8(I8)
N$550: U54.13(7Q) U63.7(I7)
N$551: U54.14(6Q) U63.6(I6)
N$552: U54.15(5Q) U63.5(I5)
N$553: U54.16(4Q) U63.4(I4)
N$554: U54.17(3Q) U63.3(I3)
N$555: U54.18(2Q) U63.2(I2)
N$556: U54.19(1Q) U63.1(I1)
N$557: U59.12(8Q) U68.8(I8)
N$558: IC54.9(Y6) U60.11(CLK)
N$559: IC54.10(Y5) U59.11(CLK)
N$560: IC54.11(Y4) U58.11(CLK)
N$561: IC54.12(Y3) U57.11(CLK)
N$562: IC54.13(Y2) U56.11(CLK)
N$563: IC54.14(Y1) U55.11(CLK)
N$564: IC54.15(Y0) U54.11(CLK)
N$565: IC54.7(Y7) U61.11(CLK)
N$566: IC54.6(G1) R6.2
N$567: K8.1 U80.18(O1)
N$568: K8.2 U80.17(O2)
N$569: K8.3 U80.16(O3)
N$570: K8.4 U80.15(O4)
N$571: K8.5 U80.14(O5)
N$572: K8.6 U80.13(O6)
N$573: K8.7 U80.12(O7)
N$574: K8.8 U80.11(O8)
N$575: K8.9 U81.18(O1)
N$576: K8.10 U81.17(O2)
N$577: K8.11 U81.16(O3)
N$578: K8.12 U81.15(O4)
N$579: K8.13 U81.14(O5)
N$580: K8.14 U81.13(O6)
N$581: K8.15 U81.12(O7)
N$582: K8.16 U81.11(O8)
N$583: K8.25 U83.18(O1)
N$584: K8.26 U83.17(O2)
N$585: K8.27 U83.16(O3)
N$586: K8.28 U83.15(O4)
N$587: K8.29 U83.14(O5)
N$588: K8.30 U83.13(O6)
N$589: K8.31 U83.12(O7)
N$590: K8.32 U83.11(O8)
N$591: K8.33 U84.18(O1)
N$592: K8.34 U84.17(O2)
N$593: K8.35 U84.16(O3)
N$594: K8.36 U84.15(O4)
N$595: K8.37 U84.14(O5)
N$596: K8.38 U84.13(O6)
N$597: K8.39 U84.12(O7)
N$598: K8.40 U84.11(O8)
N$599: K8.41 U85.18(O1)
N$600: K8.42 U85.17(O2)
N$601: K8.43 U85.16(O3)
N$602: K8.44 U85.15(O4)
N$603: K8.45 U85.14(O5)
N$604: K8.46 U85.13(O6)
N$605: K8.47 U85.12(O7)
N$606: K8.48 U85.11(O8)
N$607: K8.49 U86.18(O1)
N$608: K8.50 U86.17(O2)
N$609: K8.51 U86.16(O3)
N$610: K8.52 U86.15(O4)
N$611: K8.53 U86.14(O5)
N$612: K8.54 U86.13(O6)
N$613: K8.55 U86.12(O7)
N$614: K8.56 U86.11(O8)
N$615: K8.57 U87.18(O1)
N$616: K8.58 U87.17(O2)
N$617: K8.59 U87.16(O3)
N$618: K8.60 U87.15(O4)
N$619: K8.61 U87.14(O5)
N$620: K8.62 U87.13(O6)
N$621: K8.63 U87.12(O7)
N$622: K8.64 U87.11(O8)
N$623: U78.12(8Q) U87.8(I8)
N$624: U78.13(7Q) U87.7(I7)
N$625: U78.14(6Q) U87.6(I6)
N$626: U78.15(5Q) U87.5(I5)
N$627: U78.16(4Q) U87.4(I4)
N$628: U78.17(3Q) U87.3(I3)
N$629: U78.18(2Q) U87.2(I2)
N$630: U78.19(1Q) U87.1(I1)
N$631: U77.12(8Q) U86.8(I8)
N$632: U77.13(7Q) U86.7(I7)
N$633: U77.14(6Q) U86.6(I6)
N$634: U77.15(5Q) U86.5(I5)
N$635: U77.16(4Q) U86.4(I4)
N$636: U77.17(3Q) U86.3(I3)
N$637: U77.18(2Q) U86.2(I2)
N$638: U77.19(1Q) U86.1(I1)
N$639: U75.19(1Q) U84.1(I1)
N$640: U75.18(2Q) U84.2(I2)
N$641: U75.17(3Q) U84.3(I3)
N$642: U75.16(4Q) U84.4(I4)
N$643: U75.15(5Q) U84.5(I5)
N$644: U75.14(6Q) U84.6(I6)
N$645: U75.13(7Q) U84.7(I7)
N$646: U75.12(8Q) U84.8(I8)
N$647: U76.12(8Q) U85.8(I8)
N$648: U76.13(7Q) U85.7(I7)
N$649: U76.14(6Q) U85.6(I6)
N$650: U76.15(5Q) U85.5(I5)
N$651: U76.16(4Q) U85.4(I4)
N$652: U76.17(3Q) U85.3(I3)
N$653: U76.18(2Q) U85.2(I2)
N$654: K8.17 U82.18(O1)
N$655: K8.18 U82.17(O2)
N$656: K8.19 U82.16(O3)
N$657: K8.20 U82.15(O4)
N$658: K8.21 U82.14(O5)
N$659: K8.22 U82.13(O6)
N$660: K8.23 U82.12(O7)
N$661: K8.24 U82.11(O8)
N$662: U74.12(8Q) U83.8(I8)
N$663: U74.13(7Q) U83.7(I7)
N$664: U74.14(6Q) U83.6(I6)
N$665: U74.15(5Q) U83.5(I5)
N$666: U74.16(4Q) U83.4(I4)
N$667: U74.17(3Q) U83.3(I3)
N$668: U74.18(2Q) U83.2(I2)
N$669: U74.19(1Q) U83.1(I1)
N$670: U72.19(1Q) U81.1(I1)
N$671: U72.18(2Q) U81.2(I2)
N$672: U72.17(3Q) U81.3(I3)
N$673: U72.16(4Q) U81.4(I4)
N$674: U72.15(5Q) U81.5(I5)
N$675: U72.14(6Q) U81.6(I6)
N$676: U72.13(7Q) U81.7(I7)
N$677: U72.12(8Q) U81.8(I8)
N$678: U73.19(1Q) U82.1(I1)
N$679: U73.18(2Q) U82.2(I2)
N$680: U73.17(3Q) U82.3(I3)
N$681: U73.16(4Q) U82.4(I4)
N$682: U73.15(5Q) U82.5(I5)
N$683: U73.14(6Q) U82.6(I6)
N$684: U73.13(7Q) U82.7(I7)
N$685: U73.12(8Q) U82.8(I8)
N$686: U71.12(8Q) U80.8(I8)
N$687: U71.13(7Q) U80.7(I7)
N$688: U71.14(6Q) U80.6(I6)
N$689: U71.15(5Q) U80.5(I5)
N$690: U71.16(4Q) U80.4(I4)
N$691: U71.17(3Q) U80.3(I3)
N$692: U71.18(2Q) U80.2(I2)
N$693: U71.19(1Q) U80.1(I1)
N$694: U76.19(1Q) U85.1(I1)
N$695: U77.11(CLK) U79.9(!Y6)
N$696: U76.11(CLK) U79.10(!Y5)
N$697: U75.11(CLK) U79.11(!Y4)
N$698: U74.11(CLK) U79.12(!Y3)
N$699: U73.11(CLK) U79.13(!Y2)
N$700: U72.11(CLK) U79.14(!Y1)
N$701: U71.11(CLK) U79.15(!Y0)
N$702: U78.11(CLK) U79.7(!Y7)
N$703: R7.2 U79.6(G1)
VCC: C37.1 C38.1 C39.1 C40.1 C41.1 C42.1 C43.1 C44.1 C46.1 C47.1 C48.1 C49.1 C50.1 C51.1 C52.1 C53.1 C54.1 C55.1 C56.1 C57.1 C58.1 C59.1 C60.1 C61.1 C62.1 C63.1 C204.2 C205.2 C206.2 C207.2 IC38.9(CD+) IC39.9(CD+) IC42.9(CD+) IC44.9(CD+) IC46.9(CD+) IC48.9(CD+) IC50.9(CD+) IC52.9(CD+) IC55.9(CD+) IC56.9(CD+) R5.1 R6.1 R7.1 U63.9(VPP) U64.9(VPP) U65.9(VPP) U66.9(VPP) U67.9(VPP) U68.9(VPP) U69.9(VPP) U70.9(VPP) U80.9(VPP) U81.9(VPP) U82.9(VPP) U83.9(VPP) U84.9(VPP) U85.9(VPP) U86.9(VPP) U87.9(VPP) ; also sheet 1,3,4
Unconnected: C45.1 IC56.1(I1) IC56.2(I2) IC56.3(I3) IC56.4(I4) IC56.5(I5) IC56.6(I6) IC56.11(O6) IC56.12(O5) IC56.13(O4) IC56.14(O3) IC56.15(O2) IC56.16(O1) U62.1(A) U62.2(B) U62.3(C) U62.4(!G2A) U62.5(!G2B) U62.6(G1) U62.7(!Y7) U62.9(!Y6) U62.10(!Y5) U62.11(!Y4) U62.12(!Y3) U62.13(!Y2) U62.14(!Y1) U62.15(!Y0)

### Buses
D[0..7]
A[0..5],E[0..15],IL,OL

### Notes on the sheet
- REJSTRIKY - VYSTUPY